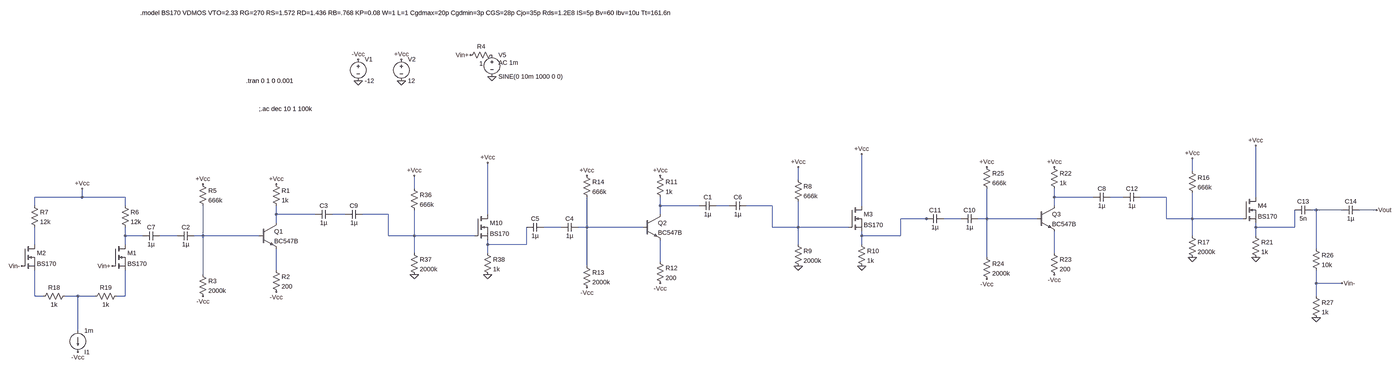
[diagram p0: schematic v9.asc, whole sheet]
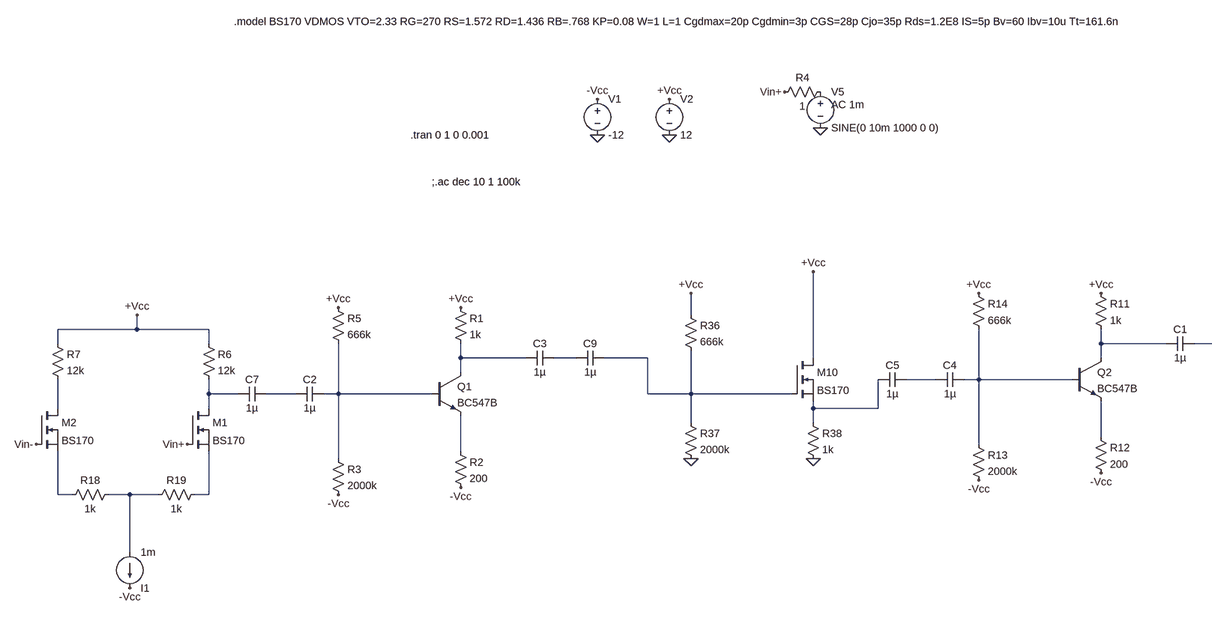
[diagram p1: schematic v9.asc, part, row 1 of 1, column 1 of 2]
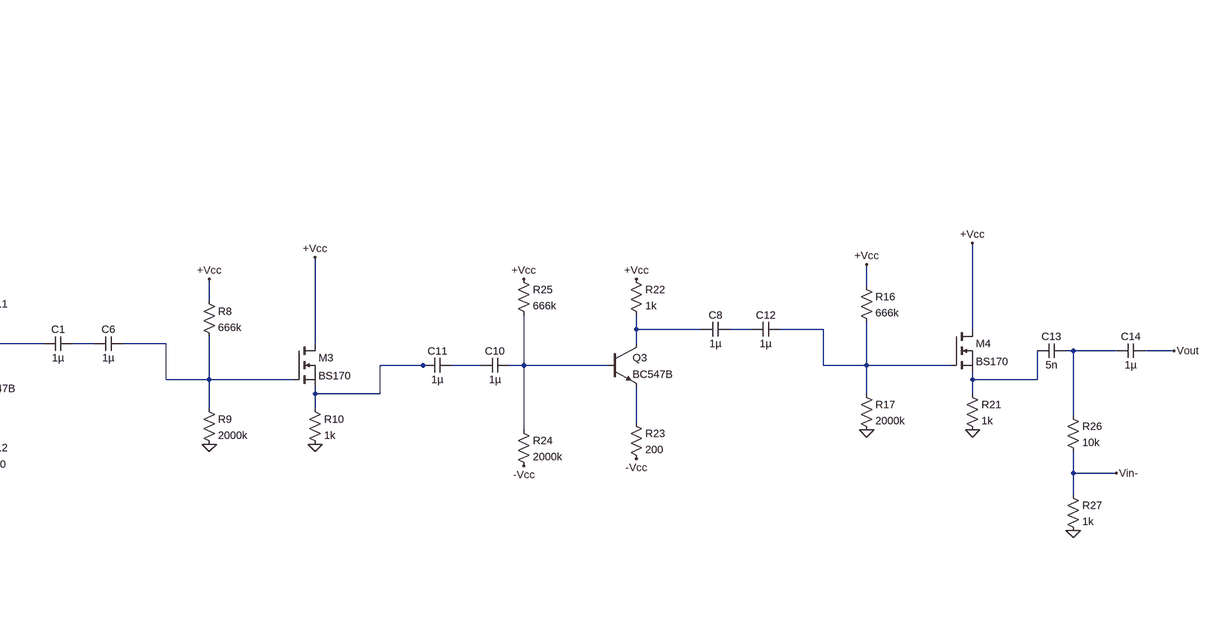
[diagram p2: schematic v9.asc, part, row 1 of 1, column 2 of 2]
v9.asc, the LTspice schematic file:
Version 4
SHEET 1 4084 732
WIRE 2336 -1424 2336 -1472
WIRE 816 -1392 816 -1440
WIRE -608 -1360 -608 -1408
WIRE -1840 -1328 -1840 -1360
WIRE -1840 -1328 -2016 -1328
WIRE -1680 -1328 -1840 -1328
WIRE 1824 -1328 1824 -1360
WIRE 1968 -1328 1824 -1328
WIRE 2080 -1328 2032 -1328
WIRE 2240 -1328 2144 -1328
WIRE 2608 -1328 2608 -1520
WIRE -2016 -1296 -2016 -1328
WIRE -1680 -1296 -1680 -1328
WIRE 304 -1296 304 -1328
WIRE 448 -1296 304 -1296
WIRE 560 -1296 512 -1296
WIRE 720 -1296 624 -1296
WIRE 1088 -1296 1088 -1488
WIRE 1824 -1296 1824 -1328
WIRE 2832 -1280 2816 -1280
WIRE 2928 -1280 2832 -1280
WIRE 3056 -1280 2992 -1280
WIRE -1120 -1264 -1120 -1296
WIRE -976 -1264 -1120 -1264
WIRE -864 -1264 -912 -1264
WIRE -704 -1264 -800 -1264
WIRE -336 -1264 -336 -1456
WIRE 304 -1264 304 -1296
WIRE 1328 -1248 1232 -1248
WIRE 1344 -1248 1328 -1248
WIRE 1456 -1248 1392 -1248
WIRE 1552 -1248 1552 -1360
WIRE 1552 -1248 1520 -1248
WIRE 1760 -1248 1552 -1248
WIRE 2240 -1248 2240 -1328
WIRE 2336 -1248 2336 -1344
WIRE 2336 -1248 2240 -1248
WIRE 2560 -1248 2336 -1248
WIRE -1120 -1232 -1120 -1264
WIRE -64 -1216 -128 -1216
WIRE 32 -1216 32 -1328
WIRE 32 -1216 0 -1216
WIRE 240 -1216 32 -1216
WIRE 720 -1216 720 -1296
WIRE 816 -1216 816 -1312
WIRE 816 -1216 720 -1216
WIRE 1040 -1216 816 -1216
WIRE 2608 -1216 2608 -1232
WIRE 2752 -1216 2752 -1280
WIRE 2752 -1216 2608 -1216
WIRE -1680 -1184 -1680 -1216
WIRE -1616 -1184 -1680 -1184
WIRE -1488 -1184 -1552 -1184
WIRE -1392 -1184 -1392 -1296
WIRE -1392 -1184 -1424 -1184
WIRE -1184 -1184 -1392 -1184
WIRE -704 -1184 -704 -1264
WIRE -608 -1184 -608 -1280
WIRE -608 -1184 -704 -1184
WIRE -384 -1184 -608 -1184
WIRE 1088 -1184 1088 -1200
WIRE 1232 -1184 1232 -1248
WIRE 1232 -1184 1088 -1184
WIRE 2336 -1184 2336 -1248
WIRE 2608 -1184 2608 -1216
WIRE -2016 -1152 -2016 -1216
WIRE -1680 -1152 -1680 -1184
WIRE -336 -1152 -336 -1168
WIRE -192 -1152 -192 -1216
WIRE -192 -1152 -336 -1152
WIRE 816 -1152 816 -1216
WIRE 1088 -1152 1088 -1184
WIRE 2832 -1136 2832 -1280
WIRE -608 -1120 -608 -1184
WIRE -336 -1120 -336 -1152
WIRE 1824 -1120 1824 -1200
WIRE 1552 -1104 1552 -1248
WIRE 304 -1088 304 -1168
WIRE 32 -1072 32 -1216
WIRE -1120 -1056 -1120 -1136
WIRE -1392 -1040 -1392 -1184
WIRE 2832 -1008 2832 -1056
WIRE 2928 -1008 2832 -1008
WIRE -2016 -960 -2016 -1056
WIRE -1984 -960 -2016 -960
WIRE -1856 -960 -1904 -960
WIRE -1792 -960 -1856 -960
WIRE -1680 -960 -1680 -1056
WIRE -1680 -960 -1712 -960
WIRE 2832 -960 2832 -1008
WIRE -1856 -832 -1856 -960
FLAG -816 -1760 0
FLAG -656 -1760 0
FLAG -816 -1840 -Vcc
FLAG -656 -1840 +Vcc
FLAG -320 -1776 0
FLAG -400 -1856 Vin+
FLAG -608 -1408 +Vcc
FLAG -336 -1456 +Vcc
FLAG -1392 -1376 +Vcc
FLAG -1120 -1376 +Vcc
FLAG -336 -1040 0
FLAG -608 -1040 0
FLAG -1840 -1360 +Vcc
FLAG -1856 -752 -Vcc
FLAG -1392 -960 -Vcc
FLAG -1120 -976 -Vcc
FLAG -1728 -1072 Vin+
FLAG 816 -1440 +Vcc
FLAG 1088 -1488 +Vcc
FLAG 32 -1408 +Vcc
FLAG 304 -1408 +Vcc
FLAG 1088 -1072 0
FLAG 816 -1072 0
FLAG 32 -992 -Vcc
FLAG 304 -1008 -Vcc
FLAG 2336 -1472 +Vcc
FLAG 2608 -1520 +Vcc
FLAG 1552 -1440 +Vcc
FLAG 1824 -1440 +Vcc
FLAG 2608 -1104 0
FLAG 2336 -1104 0
FLAG 1552 -1024 -Vcc
FLAG 1824 -1040 -Vcc
FLAG 2832 -880 0
FLAG 2928 -1008 Vin-
FLAG 3056 -1280 Vout
FLAG -2064 -1072 Vin-
SYMBOL voltage -816 -1856 R0
WINDOW 123 0 0 Left 0
WINDOW 39 0 0 Left 0
SYMATTR InstName V1
SYMATTR Value -12
SYMBOL voltage -656 -1856 R0
WINDOW 123 0 0 Left 0
WINDOW 39 0 0 Left 0
SYMATTR InstName V2
SYMATTR Value 12
SYMBOL voltage -320 -1872 R0
WINDOW 123 24 44 Left 2
WINDOW 39 0 0 Left 0
SYMATTR Value2 AC 1m
SYMATTR InstName V5
SYMATTR Value SINE(0 10m 1000 0 0)
SYMBOL res -304 -1872 R90
WINDOW 0 0 56 VBottom 2
WINDOW 3 32 56 VTop 2
SYMATTR InstName R4
SYMATTR Value 1
SYMBOL nmos -384 -1264 R0
SYMATTR InstName M10
SYMATTR Value BS170
SYMBOL res -624 -1376 R0
SYMATTR InstName R36
SYMATTR Value 666k
SYMBOL res -624 -1136 R0
SYMATTR InstName R37
SYMATTR Value 2000k
SYMBOL res -352 -1136 R0
SYMATTR InstName R38
SYMATTR Value 1k
SYMBOL npn -1184 -1232 R0
SYMATTR InstName Q1
SYMATTR Value BC547B
SYMBOL res -1136 -1392 R0
SYMATTR InstName R1
SYMATTR Value 1k
SYMBOL res -1136 -1072 R0
SYMATTR InstName R2
SYMATTR Value 200
SYMBOL res -1408 -1056 R0
SYMATTR InstName R3
SYMATTR Value 2000k
SYMBOL res -1408 -1392 R0
SYMATTR InstName R5
SYMATTR Value 666k
SYMBOL cap -912 -1280 R90
WINDOW 0 0 32 VBottom 2
WINDOW 3 32 32 VTop 2
SYMATTR InstName C3
SYMATTR Value 1µ
SYMBOL nmos -2064 -1152 R0
SYMATTR InstName M2
SYMATTR Value BS170
SYMBOL res -1696 -1312 R0
SYMATTR InstName R6
SYMATTR Value 12k
SYMBOL res -2032 -1312 R0
SYMATTR InstName R7
SYMATTR Value 12k
SYMBOL current -1856 -832 R0
WINDOW 0 24 80 Left 2
WINDOW 3 24 0 Left 2
WINDOW 123 0 0 Left 0
WINDOW 39 0 0 Left 0
SYMATTR InstName I1
SYMATTR Value 1m
SYMBOL nmos -1728 -1152 R0
SYMATTR InstName M1
SYMATTR Value BS170
SYMBOL res -1888 -976 R90
WINDOW 0 0 56 VBottom 2
WINDOW 3 32 56 VTop 2
SYMATTR InstName R18
SYMATTR Value 1k
SYMBOL res -1696 -976 R90
WINDOW 0 0 56 VBottom 2
WINDOW 3 32 56 VTop 2
SYMATTR InstName R19
SYMATTR Value 1k
SYMBOL cap -1424 -1200 R90
WINDOW 0 0 32 VBottom 2
WINDOW 3 32 32 VTop 2
SYMATTR InstName C2
SYMATTR Value 1µ
SYMBOL cap -1552 -1200 R90
WINDOW 0 0 32 VBottom 2
WINDOW 3 32 32 VTop 2
SYMATTR InstName C7
SYMATTR Value 1µ
SYMBOL cap -800 -1280 R90
WINDOW 0 0 32 VBottom 2
WINDOW 3 32 32 VTop 2
SYMATTR InstName C9
SYMATTR Value 1µ
SYMBOL nmos 1040 -1296 R0
SYMATTR InstName M3
SYMATTR Value BS170
SYMBOL res 800 -1408 R0
SYMATTR InstName R8
SYMATTR Value 666k
SYMBOL res 800 -1168 R0
SYMATTR InstName R9
SYMATTR Value 2000k
SYMBOL res 1072 -1168 R0
SYMATTR InstName R10
SYMATTR Value 1k
SYMBOL npn 240 -1264 R0
SYMATTR InstName Q2
SYMATTR Value BC547B
SYMBOL res 288 -1424 R0
SYMATTR InstName R11
SYMATTR Value 1k
SYMBOL res 288 -1104 R0
SYMATTR InstName R12
SYMATTR Value 200
SYMBOL res 16 -1088 R0
SYMATTR InstName R13
SYMATTR Value 2000k
SYMBOL res 16 -1424 R0
SYMATTR InstName R14
SYMATTR Value 666k
SYMBOL cap 512 -1312 R90
WINDOW 0 0 32 VBottom 2
WINDOW 3 32 32 VTop 2
SYMATTR InstName C1
SYMATTR Value 1µ
SYMBOL cap 0 -1232 R90
WINDOW 0 0 32 VBottom 2
WINDOW 3 32 32 VTop 2
SYMATTR InstName C4
SYMATTR Value 1µ
SYMBOL cap -128 -1232 R90
WINDOW 0 0 32 VBottom 2
WINDOW 3 32 32 VTop 2
SYMATTR InstName C5
SYMATTR Value 1µ
SYMBOL cap 624 -1312 R90
WINDOW 0 0 32 VBottom 2
WINDOW 3 32 32 VTop 2
SYMATTR InstName C6
SYMATTR Value 1µ
SYMBOL nmos 2560 -1328 R0
SYMATTR InstName M4
SYMATTR Value BS170
SYMBOL res 2320 -1440 R0
SYMATTR InstName R16
SYMATTR Value 666k
SYMBOL res 2320 -1200 R0
SYMATTR InstName R17
SYMATTR Value 2000k
SYMBOL res 2592 -1200 R0
SYMATTR InstName R21
SYMATTR Value 1k
SYMBOL npn 1760 -1296 R0
SYMATTR InstName Q3
SYMATTR Value BC547B
SYMBOL res 1808 -1456 R0
SYMATTR InstName R22
SYMATTR Value 1k
SYMBOL res 1808 -1136 R0
SYMATTR InstName R23
SYMATTR Value 200
SYMBOL res 1536 -1120 R0
SYMATTR InstName R24
SYMATTR Value 2000k
SYMBOL res 1536 -1456 R0
SYMATTR InstName R25
SYMATTR Value 666k
SYMBOL cap 2032 -1344 R90
WINDOW 0 0 32 VBottom 2
WINDOW 3 32 32 VTop 2
SYMATTR InstName C8
SYMATTR Value 1µ
SYMBOL cap 1520 -1264 R90
WINDOW 0 0 32 VBottom 2
WINDOW 3 32 32 VTop 2
SYMATTR InstName C10
SYMATTR Value 1µ
SYMBOL cap 1392 -1264 R90
WINDOW 0 0 32 VBottom 2
WINDOW 3 32 32 VTop 2
SYMATTR InstName C11
SYMATTR Value 1µ
SYMBOL cap 2144 -1344 R90
WINDOW 0 0 32 VBottom 2
WINDOW 3 32 32 VTop 2
SYMATTR InstName C12
SYMATTR Value 1µ
SYMBOL res 2816 -1152 R0
SYMATTR InstName R26
SYMATTR Value 10k
SYMBOL res 2816 -976 R0
SYMATTR InstName R27
SYMATTR Value 1k
SYMBOL cap 2816 -1296 R90
WINDOW 0 0 32 VBottom 2
WINDOW 3 32 32 VTop 2
SYMATTR InstName C13
SYMATTR Value 5n
SYMBOL cap 2992 -1296 R90
WINDOW 0 0 32 VBottom 2
WINDOW 3 32 32 VTop 2
SYMATTR InstName C14
SYMATTR Value 1µ
TEXT -1232 -1760 Left 2 !.tran 0 1 0 0.001
TEXT -1624 -2048 Left 2 !.model BS170 VDMOS VTO=2.33 RG=270 RS=1.572 RD=1.436 RB=.768 KP=0.08 W=1 L=1 Cgdmax=20p Cgdmin=3p CGS=28p Cjo=35p Rds=1.2E8 IS=5p Bv=60 Ibv=10u Tt=161.6n
TEXT -1184 -1656 Left 2 !;.ac dec 10 1 100k

The netlist it stands for:
* v9.asc
V1 -Vcc 0 -12
V2 +Vcc 0 12
V5 P001 0 SINE(0 10m 1000 0 0) AC 1m
R4 P001 Vin+ 1
M10 +Vcc N010 N021 N021 BS170
R36 +Vcc N010 666k
R37 N010 0 2000k
R38 N021 0 1k
Q1 N008 N019 N024 0 BC547B
R1 +Vcc N008 1k
R2 N024 -Vcc 200
R3 N019 -Vcc 2000k
R5 +Vcc N019 666k
C3 N009 N008 1µ
M2 N020 Vin- N025 N025 BS170
R6 +Vcc N017 12k
R7 +Vcc N020 12k
I1 N026 -Vcc 1m
M1 N017 Vin+ N027 N027 BS170
R18 N026 N025 1k
R19 N027 N026 1k
C2 N019 N018 1µ
C7 N018 N017 1µ
C9 N010 N009 1µ
M3 +Vcc N006 N011 N011 BS170
R8 +Vcc N006 666k
R9 N006 0 2000k
R10 N011 0 1k
Q2 N004 N015 N023 0 BC547B
R11 +Vcc N004 1k
R12 N023 -Vcc 200
R13 N015 -Vcc 2000k
R14 +Vcc N015 666k
C1 N005 N004 1µ
C4 N015 N014 1µ
C5 N014 N021 1µ
C6 N006 N005 1µ
M4 +Vcc N003 N016 N016 BS170
R16 +Vcc N003 666k
R17 N003 0 2000k
R21 N016 0 1k
Q3 N001 N013 N022 0 BC547B
R22 +Vcc N001 1k
R23 N022 -Vcc 200
R24 N013 -Vcc 2000k
R25 +Vcc N013 666k
C8 N002 N001 1µ
C10 N013 N012 1µ
C11 N012 N011 1µ
C12 N003 N002 1µ
R26 N007 Vin- 10k
R27 Vin- 0 1k
C13 N007 N016 5n
C14 Vout N007 1µ
.model NPN NPN
.model PNP PNP
.lib standard.bjt
.model NMOS NMOS
.model PMOS PMOS
.lib standard.mos
.tran 0 1 0 0.001
.model BS170 VDMOS VTO=2.33 RG=270 RS=1.572 RD=1.436 RB=.768 KP=0.08 W=1 L=1 Cgdmax=20p Cgdmin=3p CGS=28p Cjo=35p Rds=1.2E8 IS=5p Bv=60 Ibv=10u Tt=161.6n
;.ac dec 10 1 100k
.backanno
.end